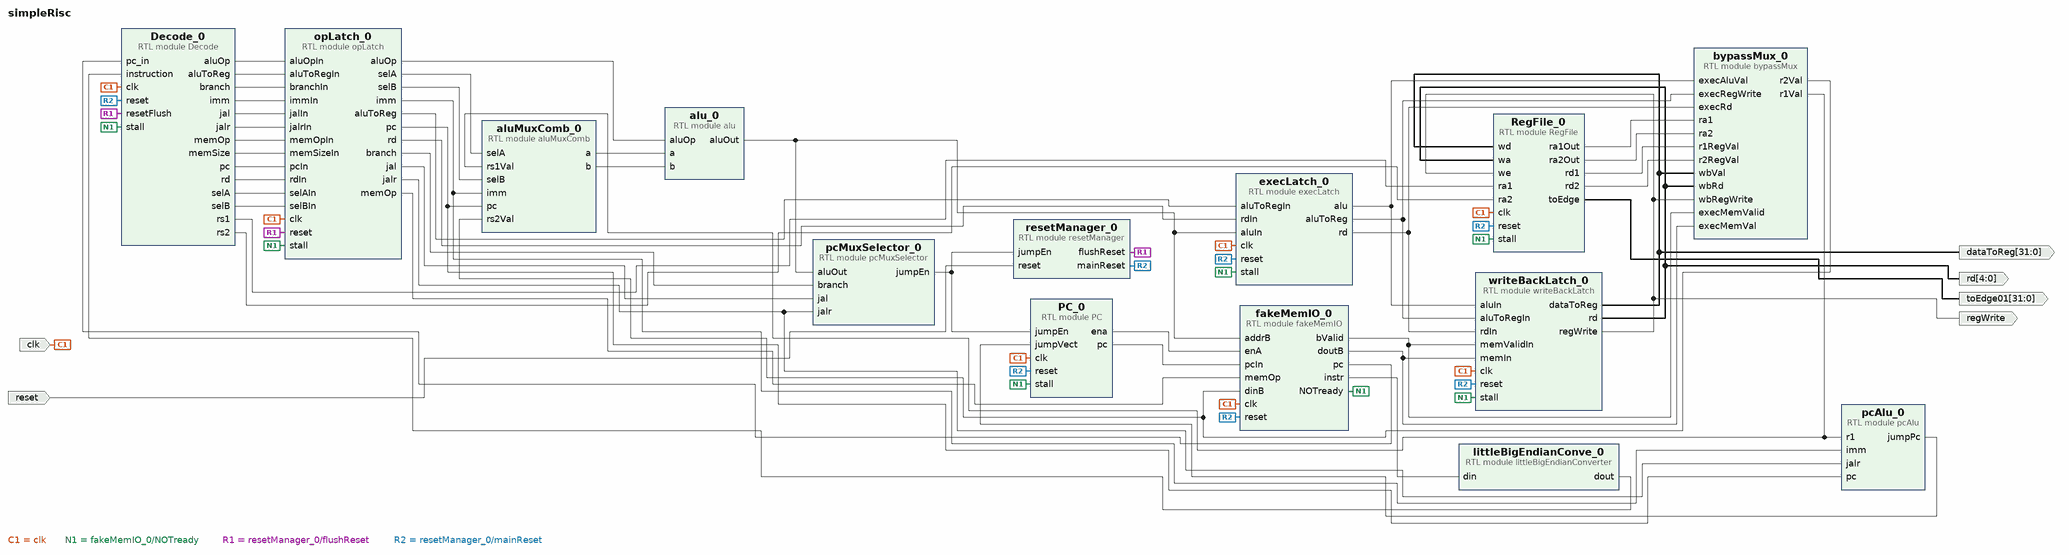
[diagram p0: block diagram of the top level]
# Vivado block design simpleRisc, xc7z007sclg400-1, Vivado 2023.1
create_bd_design simpleRisc

create_bd_port -dir I reset
create_bd_port -dir O -from 4 -to 0 rd
create_bd_port -dir O regWrite
create_bd_port -dir O -from 31 -to 0 dataToReg
create_bd_port -dir O -from 31 -to 0 toEdge01
create_bd_port -dir I -type clk clk
set_property -dict {CONFIG.FREQ_HZ 1000000} [get_bd_ports clk]

create_bd_cell -type module -reference aluMuxComb aluMuxComb_0
create_bd_cell -type module -reference RegFile RegFile_0
create_bd_cell -type module -reference writeBackLatch writeBackLatch_0
create_bd_cell -type module -reference bypassMux bypassMux_0
create_bd_cell -type module -reference opLatch opLatch_0
create_bd_cell -type module -reference alu alu_0
create_bd_cell -type module -reference pcAlu pcAlu_0
create_bd_cell -type module -reference pcMuxSelector pcMuxSelector_0
create_bd_cell -type module -reference execLatch execLatch_0
create_bd_cell -type module -reference resetManager resetManager_0
create_bd_cell -type module -reference PC PC_0
create_bd_cell -type module -reference Decode Decode_0
create_bd_cell -type module -reference fakeMemIO fakeMemIO_0
create_bd_cell -type module -reference littleBigEndianConverter littleBigEndianConve_0

# ---- connections ----

connect_bd_net [get_bd_pins Decode_0/aluOp] [get_bd_pins opLatch_0/aluOpIn]
connect_bd_net [get_bd_pins Decode_0/aluToReg] [get_bd_pins opLatch_0/aluToRegIn]
connect_bd_net [get_bd_pins Decode_0/branch] [get_bd_pins opLatch_0/branchIn]
connect_bd_net [get_bd_pins Decode_0/imm] [get_bd_pins opLatch_0/immIn]
connect_bd_net [get_bd_pins Decode_0/jal] [get_bd_pins opLatch_0/jalIn]
connect_bd_net [get_bd_pins Decode_0/jalr] [get_bd_pins opLatch_0/jalrIn]
connect_bd_net [get_bd_pins Decode_0/memOp] [get_bd_pins opLatch_0/memOpIn]
connect_bd_net [get_bd_pins Decode_0/memSize] [get_bd_pins opLatch_0/memSizeIn]
connect_bd_net [get_bd_pins Decode_0/pc] [get_bd_pins opLatch_0/pcIn]
connect_bd_net [get_bd_pins Decode_0/rd] [get_bd_pins opLatch_0/rdIn]
connect_bd_net [get_bd_pins Decode_0/rs1] [get_bd_pins RegFile_0/ra1]
connect_bd_net [get_bd_pins Decode_0/rs2] [get_bd_pins RegFile_0/ra2]
connect_bd_net [get_bd_pins Decode_0/selA] [get_bd_pins opLatch_0/selAIn]
connect_bd_net [get_bd_pins Decode_0/selB] [get_bd_pins opLatch_0/selBIn]
connect_bd_net [get_bd_pins PC_0/ena] [get_bd_pins fakeMemIO_0/enA]
connect_bd_net [get_bd_pins PC_0/pc] [get_bd_pins fakeMemIO_0/pcIn]
connect_bd_net [get_bd_pins RegFile_0/ra1Out] [get_bd_pins bypassMux_0/ra1]
connect_bd_net [get_bd_pins RegFile_0/ra2Out] [get_bd_pins bypassMux_0/ra2]
connect_bd_net [get_bd_pins RegFile_0/rd1] [get_bd_pins bypassMux_0/r1RegVal]
connect_bd_net [get_bd_pins RegFile_0/rd2] [get_bd_pins bypassMux_0/r2RegVal]
connect_bd_net [get_bd_pins RegFile_0/toEdge] [get_bd_ports toEdge01]
connect_bd_net [get_bd_pins aluMuxComb_0/a] [get_bd_pins alu_0/a]
connect_bd_net [get_bd_pins aluMuxComb_0/b] [get_bd_pins alu_0/b]
connect_bd_net [get_bd_pins alu_0/aluOut] [get_bd_pins pcMuxSelector_0/aluOut] [get_bd_pins execLatch_0/aluIn] [get_bd_pins fakeMemIO_0/addrB]
connect_bd_net [get_bd_pins bypassMux_0/r1Val] [get_bd_pins aluMuxComb_0/rs1Val] [get_bd_pins pcAlu_0/r1]
connect_bd_net [get_bd_pins bypassMux_0/r2Val] [get_bd_pins aluMuxComb_0/rs2Val] [get_bd_pins fakeMemIO_0/dinB]
connect_bd_net [get_bd_ports clk] \
  [get_bd_pins RegFile_0/clk] [get_bd_pins writeBackLatch_0/clk] [get_bd_pins opLatch_0/clk] [get_bd_pins execLatch_0/clk] \
  [get_bd_pins PC_0/clk] [get_bd_pins Decode_0/clk] [get_bd_pins fakeMemIO_0/clk]
connect_bd_net [get_bd_pins execLatch_0/alu] [get_bd_pins writeBackLatch_0/aluIn] [get_bd_pins bypassMux_0/execAluVal]
connect_bd_net [get_bd_pins execLatch_0/aluToReg] [get_bd_pins bypassMux_0/execRegWrite] [get_bd_pins writeBackLatch_0/aluToRegIn]
connect_bd_net [get_bd_pins execLatch_0/rd] [get_bd_pins writeBackLatch_0/rdIn] [get_bd_pins bypassMux_0/execRd]
connect_bd_net [get_bd_pins fakeMemIO_0/NOTready] \
  [get_bd_pins writeBackLatch_0/stall] [get_bd_pins execLatch_0/stall] [get_bd_pins opLatch_0/stall] \
  [get_bd_pins RegFile_0/stall] [get_bd_pins Decode_0/stall] [get_bd_pins PC_0/stall]
connect_bd_net [get_bd_pins fakeMemIO_0/bValid] [get_bd_pins writeBackLatch_0/memValidIn] [get_bd_pins bypassMux_0/execMemValid]
connect_bd_net [get_bd_pins fakeMemIO_0/doutB] [get_bd_pins writeBackLatch_0/memIn] [get_bd_pins bypassMux_0/execMemVal]
connect_bd_net [get_bd_pins fakeMemIO_0/instr] [get_bd_pins littleBigEndianConve_0/din]
connect_bd_net [get_bd_pins fakeMemIO_0/pc] [get_bd_pins Decode_0/pc_in]
connect_bd_net [get_bd_pins littleBigEndianConve_0/dout] [get_bd_pins Decode_0/instruction]
connect_bd_net [get_bd_pins opLatch_0/aluOp] [get_bd_pins alu_0/aluOp]
connect_bd_net [get_bd_pins opLatch_0/aluToReg] [get_bd_pins execLatch_0/aluToRegIn]
connect_bd_net [get_bd_pins opLatch_0/branch] [get_bd_pins pcMuxSelector_0/branch]
connect_bd_net [get_bd_pins opLatch_0/imm] [get_bd_pins aluMuxComb_0/imm] [get_bd_pins pcAlu_0/imm]
connect_bd_net [get_bd_pins opLatch_0/jal] [get_bd_pins pcMuxSelector_0/jal]
connect_bd_net [get_bd_pins opLatch_0/jalr] [get_bd_pins pcAlu_0/jalr] [get_bd_pins pcMuxSelector_0/jalr]
connect_bd_net [get_bd_pins opLatch_0/memOp] [get_bd_pins fakeMemIO_0/memOp]
connect_bd_net [get_bd_pins opLatch_0/pc] [get_bd_pins aluMuxComb_0/pc] [get_bd_pins pcAlu_0/pc]
connect_bd_net [get_bd_pins opLatch_0/rd] [get_bd_pins execLatch_0/rdIn]
connect_bd_net [get_bd_pins opLatch_0/selA] [get_bd_pins aluMuxComb_0/selA]
connect_bd_net [get_bd_pins opLatch_0/selB] [get_bd_pins aluMuxComb_0/selB]
connect_bd_net [get_bd_pins pcAlu_0/jumpPc] [get_bd_pins PC_0/jumpVect]
connect_bd_net [get_bd_pins pcMuxSelector_0/jumpEn] [get_bd_pins resetManager_0/jumpEn] [get_bd_pins PC_0/jumpEn]
connect_bd_net [get_bd_pins resetManager_0/flushReset] [get_bd_pins opLatch_0/reset] [get_bd_pins Decode_0/resetFlush]
connect_bd_net [get_bd_pins resetManager_0/mainReset] \
  [get_bd_pins PC_0/reset] [get_bd_pins RegFile_0/reset] [get_bd_pins writeBackLatch_0/reset] [get_bd_pins execLatch_0/reset] \
  [get_bd_pins Decode_0/reset] [get_bd_pins fakeMemIO_0/reset]
connect_bd_net [get_bd_ports reset] [get_bd_pins resetManager_0/reset]
connect_bd_net [get_bd_pins writeBackLatch_0/dataToReg] [get_bd_ports dataToReg] [get_bd_pins RegFile_0/wd] [get_bd_pins bypassMux_0/wbVal]
connect_bd_net [get_bd_pins writeBackLatch_0/rd] [get_bd_ports rd] [get_bd_pins RegFile_0/wa] [get_bd_pins bypassMux_0/wbRd]
connect_bd_net [get_bd_pins writeBackLatch_0/regWrite] [get_bd_ports regWrite] [get_bd_pins RegFile_0/we] [get_bd_pins bypassMux_0/wbRegWrite]

validate_bd_design
save_bd_design
